# Altium schematic sheet GSMRelay_vz.SchDoc
size A3
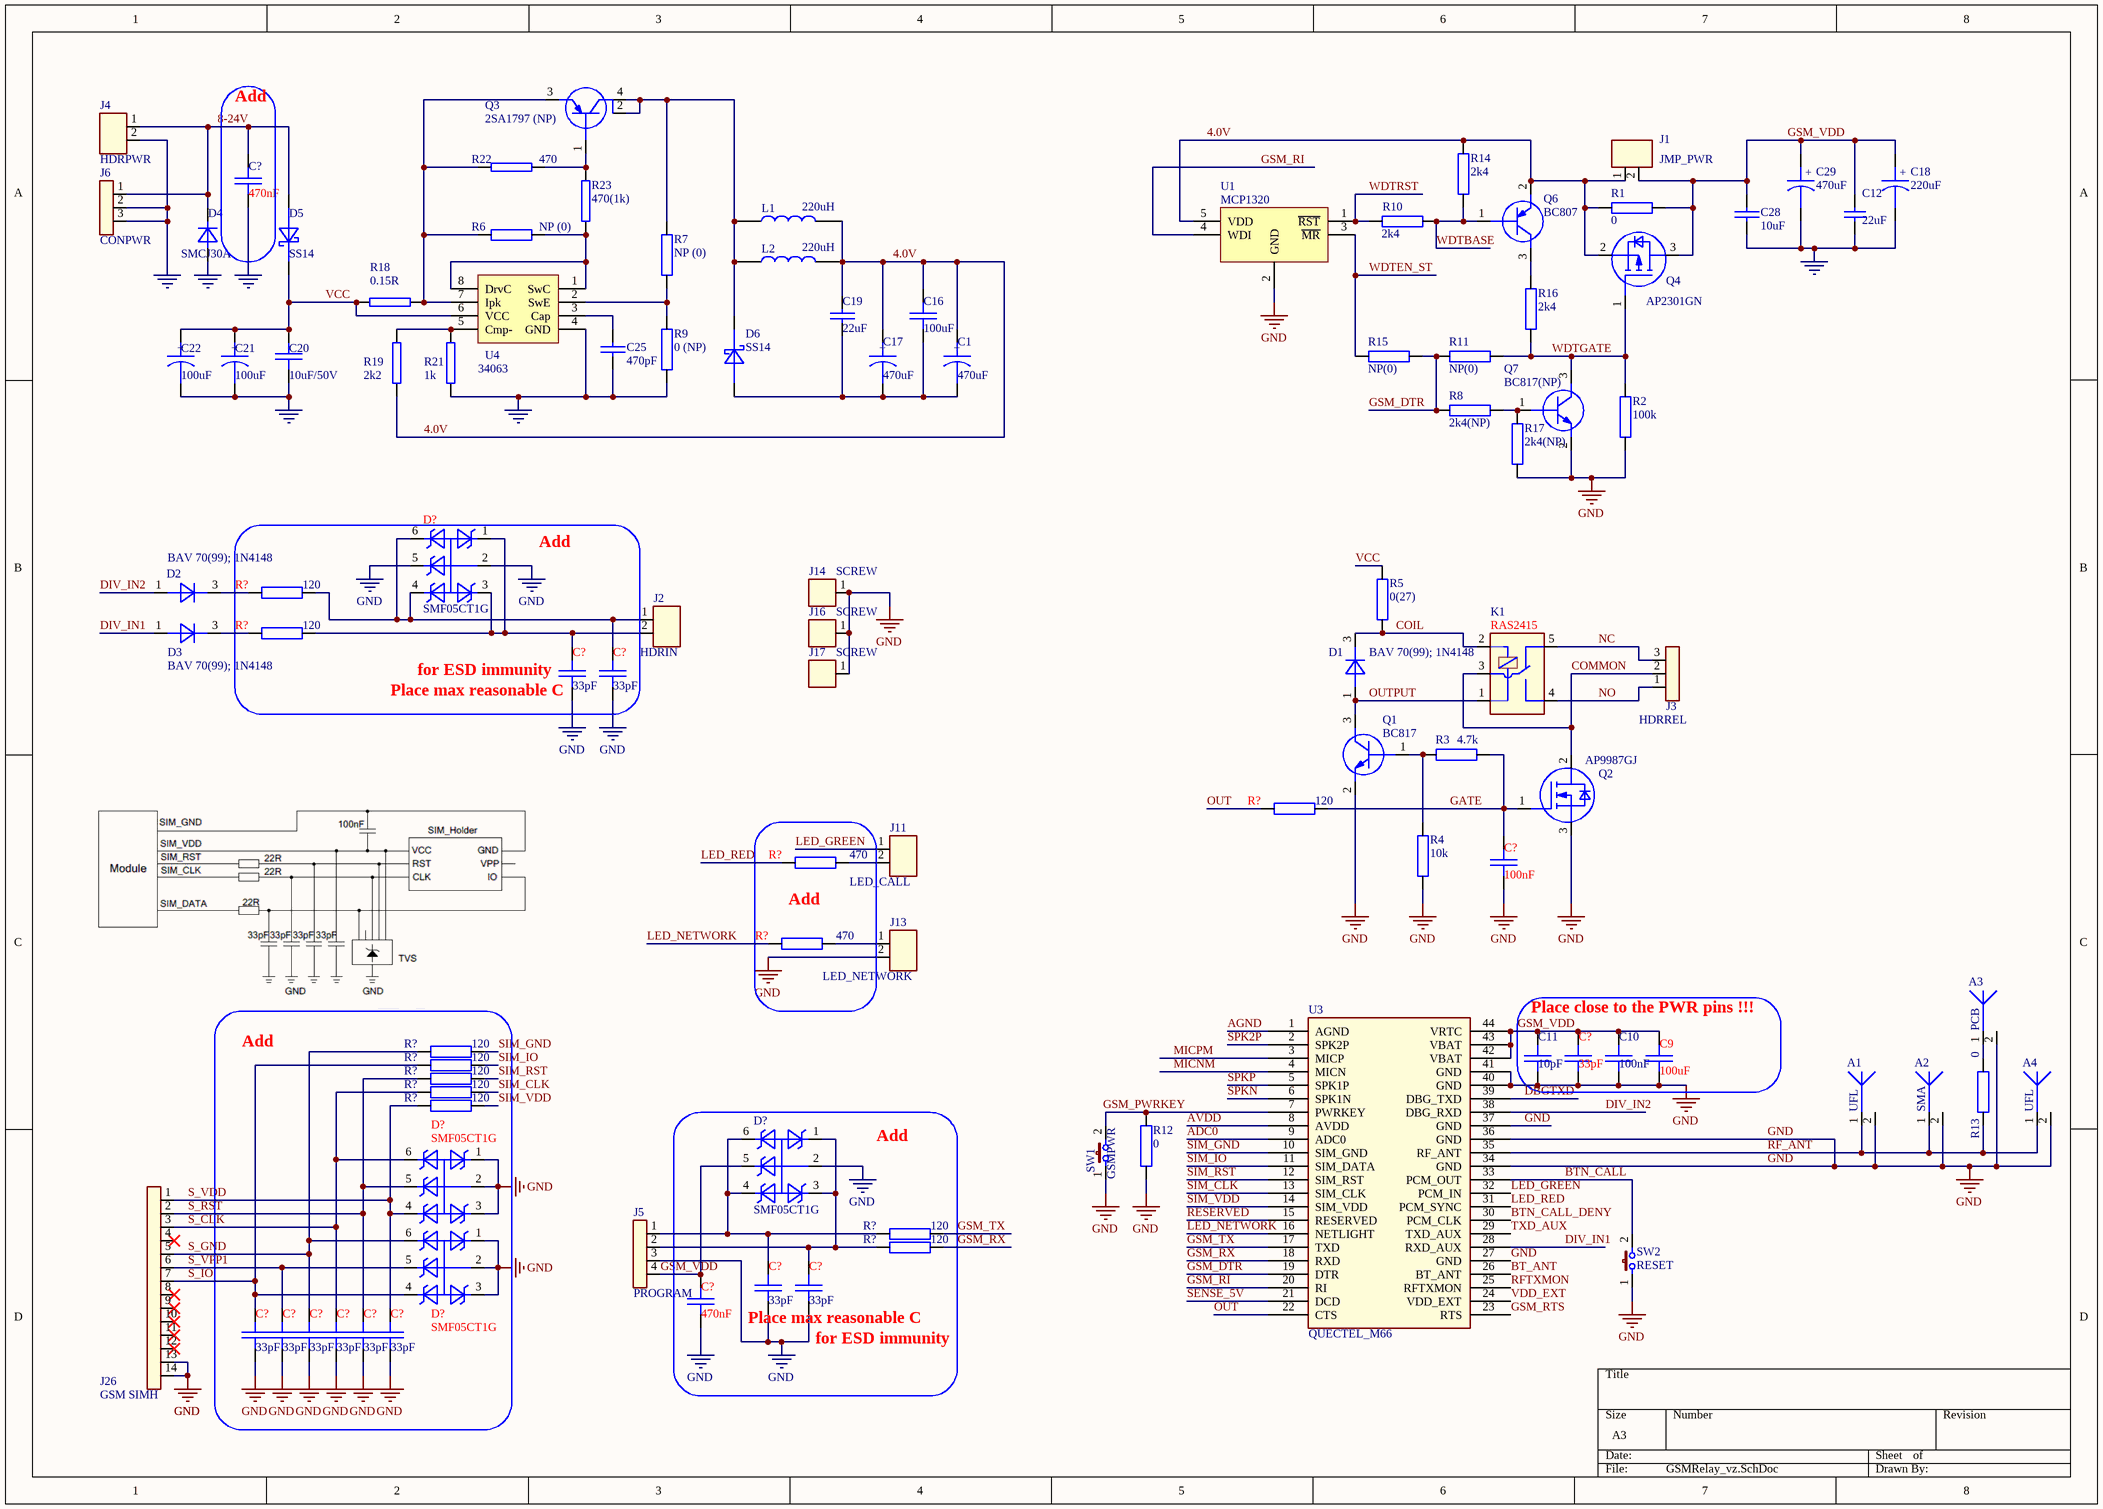
[diagram p0: GSMRelay_vz.SchDoc]

## Parts
(Parts that share a designator on the sheet are numbered #1, #2 ... from top to bottom, then left to right.)
A1  UFL  [SMD_CON_ANTENNA_UFL]
A2  SMA  [SMD_CON_ANTENNA_SMA_RIGHT_ANGLE]
A3  PCB  [SMD_CON_ANTENNA_GSM_PCB_1]
A4  UFL  [SMD_CON_ANTENNA_UFL]
C1  470uF  [SMD_CAPAE660X550N]
C9  100uF  [SMD_1210_CAPC3225X279N]
C10  100nF  [SMD_0603_CAPC1608X95N]
C11  10pF  [SMD_0603_CAPC1608X95N]
C12  22uF  [SMD_1210_CAPC3225X279N]
C16  100uF  [SMD_1210_CAPC3225X279N]
C17  470uF  [PTH_CAPPR250-800X800]
C18  220uF  [SMD_CAPAE660X550N]
C19  22uF  [SMD_0805_CAPC2012X95N]
C20  10uF/50V  [SMD_1210_CAPC3225X279N]
C21  100uF  [SMD_CAPAE660X550N]
C22  100uF  [PTH_CAPPR250-800X800]
C25  470pF  [SMD_0603_CAPC1608X95N]
C28  10uF  [SMD_0603_CAPC1608X95N]
C29  470uF  [PTH_CAPPR250-800X800]
C?#1  470nF  [SMD_0603_CAPC1608X95N]
C?#2  33pF  [SMD_0603_CAPC1608X95N]
C?#3  33pF  [SMD_0603_CAPC1608X95N]
C?#4  100nF  [SMD_0603_CAPC1608X95N]
C?#5  33pF  [SMD_0603_CAPC1608X95N]
C?#6  33pF  [SMD_0603_CAPC1608X95N]
C?#7  33pF  [SMD_0603_CAPC1608X95N]
C?#8  470nF  [SMD_0603_CAPC1608X95N]
C?#9  33pF  [SMD_0603_CAPC1608X95N]
C?#10  33pF  [SMD_0603_CAPC1608X95N]
C?#11  33pF  [SMD_0603_CAPC1608X95N]
C?#12  33pF  [SMD_0603_CAPC1608X95N]
C?#13  33pF  [SMD_0603_CAPC1608X95N]
C?#14  33pF  [SMD_0603_CAPC1608X95N]
D1  BAV 70(99); 1N4148  [SMD_SOT23_SOT95P240X120-3N]
D2  BAV 70(99); 1N4148  [SMD_SOT23_SOT95P240X120-3N]
D3  BAV 70(99); 1N4148  [SMD_SOT23_SOT95P240X120-3N]
D4  SMCJ30A  [SMD_DO214AC_SMC]
D5  SS14  [SMD_DO214AC_SMA]
D6  SS14  [SMD_DO214AC_SMA]
D?#1  SMF05CT1G  [SMD_SOT363_SOT65P210X110-6N]
D?#2  SMF05CT1G  [SMD_SOT363_SOT65P210X110-6N]
D?#3  SMF05CT1G  [SMD_SOT363_SOT65P210X110-6N]
D?#4  SMF05CT1G  [SMD_SOT363_SOT65P210X110-6N]
J1  JMP_PWR  [PTH_HDRV02W64P254_1X02]
J2  HDRIN  [PTH_HDRV02W11060P500_1X02]
J3  HDRREL  [PTH_HDRV03W11060P500_1X03]
J4  HDRPWR  [PTH_HDRV02W11060P500_1X02]
J5  PROGRAM  [PTH_HDRV04W64P254_1X04]
J6  CONPWR  [PTH_DC-POWER-JACK_210-112]
J11  LED_CALL  [PTH_LED-KINGBRIGHT-L-934SGC]
J13  LED_NETWORK  [PTH_LED-KINGBRIGHT-L-934SGC]
J14  SCREW  [PTH_MOUNT_HOLE]
J16  SCREW  [PTH_MOUNT_HOLE]
J17  SCREW  [PTH_MOUNT_HOLE]
J26  GSM SIMH  [SMD_CON-ATTEND_SIM_115B-AAA0-R01]
K1  RAS2415  [PTH_REL_RAS]
L1  220uH  [SMD_INDM600500]
L2  220uH  [PTH_CAPPR250-800X800]
Q1  BC817  [SMD_SOT23_SOT95P240X120-3N]
Q2  AP9987GJ  [PTH_TO220AB]
Q3  2SA1797 (NP)  [SMD_SOT89_SOT150P400X130-4N]
Q4  AP2301GN  [SMD_SOT23_SOT95P240X120-3N]
Q6  BC807  [SMD_SOT23_SOT95P240X120-3N]
Q7  BC817(NP)  [SMD_SOT23_SOT95P240X120-3N]
R1  0  [SMD_0603_RESC1608X55N]
R2  100k  [SMD_0603_RESC1608X55N]
R3  4.7k  [SMD_0603_RESC1608X55N]
R4  10k  [SMD_0603_RESC1608X55N]
R5  0(27)  [SMD_0603_RESC1608X55N]
R6  NP (0)  [SMD_0603_RESC1608X55N]
R7  NP (0)  [SMD_0603_RESC1608X55N]
R8  2k4(NP)  [SMD_0603_RESC1608X55N]
R9  0 (NP)  [SMD_0603_RESC1608X55N]
R10  2k4  [SMD_0603_RESC1608X55N]
R11  NP(0)  [SMD_0603_RESC1608X55N]
R12  0  [SMD_0603_RESC1608X55N]
R13  0  [SMD_0402_RESC1005X37N]
R14  2k4  [SMD_0603_RESC1608X55N]
R15  NP(0)  [SMD_0603_RESC1608X55N]
R16  2k4  [SMD_0603_RESC1608X55N]
R17  2k4(NP)  [SMD_0603_RESC1608X55N]
R18  0.15R  [SMD_0805_RESC2012X60N]
R19  2k2  [SMD_0603_RESC1608X55N]
R21  1k  [SMD_0603_RESC1608X55N]
R22  470  [SMD_0603_RESC1608X55N]
R23  470(1k)  [SMD_0603_RESC1608X55N]
R?#1  120  [SMD_0603_RESC1608X55N]
R?#2  120  [SMD_0603_RESC1608X55N]
R?#3  120  [SMD_0603_RESC1608X55N]
R?#4  470  [SMD_0603_RESC1608X55N]
R?#5  470  [SMD_0603_RESC1608X55N]
R?#6  120  [SMD_0603_RESC1608X55N]
R?#7  120  [SMD_0603_RESC1608X55N]
R?#8  120  [SMD_0603_RESC1608X55N]
R?#9  120  [SMD_0603_RESC1608X55N]
R?#10  120  [SMD_0603_RESC1608X55N]
R?#11  120  [SMD_0603_RESC1608X55N]
R?#12  120  [SMD_0603_RESC1608X55N]
SW1  GSMPWR  [SMD_SW_DTSM-3]
SW2  RESET  [SMD_SW_DTSM-3]
U1  MCP1320  [SMD_SOT26_SOT95P285X140-5N - DLV]
U3  QUECTEL_M66  [SMD_MOD_M66-44N]
U4  34063  [SMD_SOIC127P600X175-8N]

## Blocks framed on the sheet
Add: C?#1
Add: R?#4 R?#5
Add: C?#9-C?#14 D?#3 D?#4 R?#6-R?#10
Place close to the PWR pins !!!: C9-C11 C?#5

## Nets
GND: A1.2 A2.2 A3.2 A4.2 C9.1 C10.2 C11.2 C12.2 C18.2 C20.1 C21.2 C22.2 C25.2 C28.1 C29.2 C?#1.2 C?#2.2 C?#3.2 C?#4.2 C?#5.2 C?#6.2 C?#7.2 C?#8.2 C?#9.2 C?#10.2 C?#11.2 C?#12.2 C?#13.2 C?#14.2 D4.2(A) D?#1.2(AAAA) D?#1.5(C4) D?#2.2(AAAA) D?#3.1(C1) D?#3.2(AAAA) D?#3.3(C2) D?#4.1(C1) D?#4.2(AAAA) D?#4.3(C2) J4.2 J5.3 J6.2 J6.3 J13.2 J14.1 J16.1 J17.1 J26.13 J26.14 Q1.2(E) Q2.3(S) Q7.2(E) R2.1 R4.2 R9.1 R12.2 R17.1 R21.2 SW1.1 SW2.1 U1.2(GND) U3.27(GND) U3.34(GND) U3.36(GND) U3.37(GND) U3.40(GND) U3.41(GND) U4.4(GND)
4.0V: C1.1 C16.2 C17.1 C19.1 J1.1 L1.2 L2.2 Q4.2(S) Q6.2(E) R1.1 R14.2 R19.1 U1.5(VDD)
8-24V: C?#1.1 D4.1(C) D5.2(A) J4.1 J6.1
ADC0: U3.9(ADC0)
AGND: U3.1(AGND)
AVDD: U3.8(AVDD)
BT_ANT: U3.26(BT_ANT)
BTN_CALL: SW2.2 U3.33(PCM_OUT)
BTN_CALL_DENY: U3.30(PCM_CLK)
COIL: D1.3(C) K1.2 R5.1
COMMON: J3.2 K1.3 Q2.2(D)
DBGTXD: U3.39(DBG_TXD)
DIV_IN1: D3.1(A) U3.28(RXD_AUX)
DIV_IN2: D2.1(A) U3.38(DBG_RXD)
GATE: C?#4.1 Q2.1(G) R3.2 R?#3.1
GSM_DTR: R8.1 R11.2 R15.2 U3.19(DTR)
GSM_RI: U1.4(WDI) U3.20(RI)
GSM_RTS: U3.23(RTS)
GSM_RX: R?#12.1 U3.18(RXD)
GSM_TX: R?#11.1 U3.17(TXD)
GSM_VDD: C9.2 C10.1 C11.1 C12.1 C18.1 C28.2 C29.1 C?#5.1 C?#8.1 D?#2.5(C4) J1.2 J5.4 Q4.3(D) R1.2 U3.42(VBAT) U3.43(VBAT) U3.44(VRTC)
LED_GREEN: J11.1 U3.32(PCM_IN)
LED_NETWORK: R?#5.1 U3.16(NETLIGHT)
LED_RED: R?#4.2 U3.31(PCM_SYNC)
MICNM: U3.4(MICN)
MICPM: U3.3(MICP)
NC: J3.3 K1.5
NO: J3.1 K1.4
OUT: R?#3.2 U3.22(CTS)
OUTPUT: D1.1(A) K1.1 Q1.3(C)
RESERVED: U3.15(RESERVED)
RF_ANT: A1.1 A2.1 A4.1 R13.2 U3.35(RF_ANT)
RFTXMON: U3.25(RFTXMON)
S_CLK: C?#12.1 D?#3.6(C4) J26.3 R?#9.2
S_GND: C?#11.1 D?#4.6(C4) J26.5 R?#6.2
S_IO: C?#9.1 D?#4.4(C3) J26.7 R?#7.2
S_RST: C?#13.1 D?#3.5(C4) J26.2 R?#8.2
S_VDD: C?#14.1 D?#3.4(C3) J26.1 R?#10.2
S_VPP1: C?#10.1 D?#4.5(C4) J26.6
SENSE_5V: U3.21(DCD)
SIM_CLK: R?#9.1 U3.13(SIM_CLK)
SIM_GND: R?#6.1 U3.10(SIM_GND)
SIM_IO: R?#7.1 U3.11(SIM_DATA)
SIM_RST: R?#8.1 U3.12(SIM_RST)
SIM_VDD: R?#10.1 U3.14(SIM_VDD)
SPK2P: U3.2(SPK2P)
SPKN: U3.6(SPK1N)
SPKP: U3.5(SPK1P)
TXD_AUX: U3.29(TXD_AUX)
VCC: C20.2 C21.1 C22.1 D5.1(C) R5.2 R18.2 U4.6(VCC)
VDD_EXT: U3.24(VDD_EXT)
WDTBASE: Q6.1(B) R10.2 R14.1
WDTEN_ST: R15.1 U1.3(~{MR})
WDTGATE: Q4.1(G) Q7.3(C) R2.2 R11.1 R16.1
WDTRST: R10.1 U1.1(~{RST})
NetA3_1: A3.1 R13.1
NetC1_2: C1.2 C16.1 C17.2 C19.2 D6.2(A)
NetC25_1: C25.1 U4.3(Cap)
NetC?#2_1: C?#2.1 D?#1.1(C1) D?#1.3(C2) J2.2 R?#2.1
NetC?#3_1: C?#3.1 D?#1.4(C3) D?#1.6(C4) J2.1 R?#1.1
NetC?#6_1: C?#6.1 D?#2.4(C3) D?#2.6(C4) J5.1 R?#11.2
NetC?#7_1: C?#7.1 D?#2.1(C1) D?#2.3(C2) J5.2 R?#12.2
NetD2_3: D2.3(C) R?#1.2
NetD3_3: D3.3(C) R?#2.2
NetD6_1: D6.1(C) L1.1 L2.1 Q3.2(E) Q3.4(C) R7.2
NetJ11_2: J11.2 R?#4.1
NetJ13_1: J13.1 R?#5.2
NetQ1_1: Q1.1(B) R3.1 R4.1
NetQ3_1: Q3.1(B) R22.2 R23.1
NetQ3_3: Q3.3(C) R6.2 R18.1 R22.1 U4.7(Ipk)
NetQ6_3: Q6.3(C) R16.2
NetQ7_1: Q7.1(B) R8.2 R17.2
NetR6_1: R6.1 R23.2 U4.1(SwC) U4.8(DrvC)
NetR7_1: R7.1 R9.2 U4.2(SwE)
NetR12_1: R12.1 SW1.2 U3.7(PWRKEY)
NetR19_2: R19.2 R21.1 U4.5(Cmp-)

Not connected (* = marked no-connect by the designer): J26 4* 8* 9* 10* 11* 12*

## Notes on the sheet
- Add
- (near C?#2) Place max reasonable C
- (near C?#2) for ESD immunity
- (near C?#6) Place max reasonable C
- (near C?#7) for ESD immunity
- Labels drawn without touching a wire or pin: GSM_PWRKEY
- (in symbol CAPACITOR POL) +

## Library data of the parts
A1-A4 = ANTENNA_2: NOTE: <NOTE>
C1 C17 C18 C21 C22 C29 = CAPACITOR POL: Capacitor
C9-C11 C16 C20 C?#1-C?#14 = C: NOTE: <NOTE>
C12 = Cap Semi: CL32A227MQVNNNE 220UF 6.3V 20% X5R 1210; Published: 8-Jun-2000; LatestRevisionDate: 29-May-2009; LatestRevisionNote: IPC-7351 Footprint Added.; PackageReference: C1206; Publisher: Altium Limited; PackageDescription: Chip Capacitor; Value: 22uF
C19 C25 C28 = CAP: Capacitor
D1-D3 = D_A1C3: 1N4148; NOTE: <NOTE>
D4 = D: NOTE: <NOTE>
D5 D6 = D_STKY: NOTE: <NOTE>
D?#1-D?#4 = D_TVS_FIVE_C1AA2C5C3C4C6: 5 IO lines TVS; NOTE: <NOTE>
J1 J2 J4 J11 J13 = CON_2PINS: NOTE: <NOTE>
J3 J6 = CON_3PINS
J5 = CON_4PINS
J14 J16 J17 = CON_1PIN: NOTE: <NOTE>
J26 = CON_14PINS
K1 = RELAY_SPDT
L1 = INDUCTOR1: FPI0504 DA54
L2 = INDUCTOR1
Q1 Q7 = BJT_NPN_B1E2C3: NOTE: <NOTE>
Q2 = MOS_N_D1_G1D2S3: NOTE: <NOTE>
Q3 = BJT_PNP_B1C2E3C4: NOTE: <NOTE>
Q4 = MOS_P_D1_G1S2D3: NOTE: <NOTE>
Q6 = BJT_PNP_B1E2C3: NOTE: <NOTE>
R1-R17 R?#1-R?#12 = R: NOTE: <NOTE>; R_BDS: R
R18 R19 R21-R23 = RES2
SW1 SW2 = BUTTON_3
U1 = IC_MCP1320: Voltage Supervisor with Watchdog
U3 = MOD_QUECTEL_M66
U4 = 34063: DC/DC converter